# Altium schematic sheet Fast PLL.SchDoc: Fast PLL (part 2 of 2)
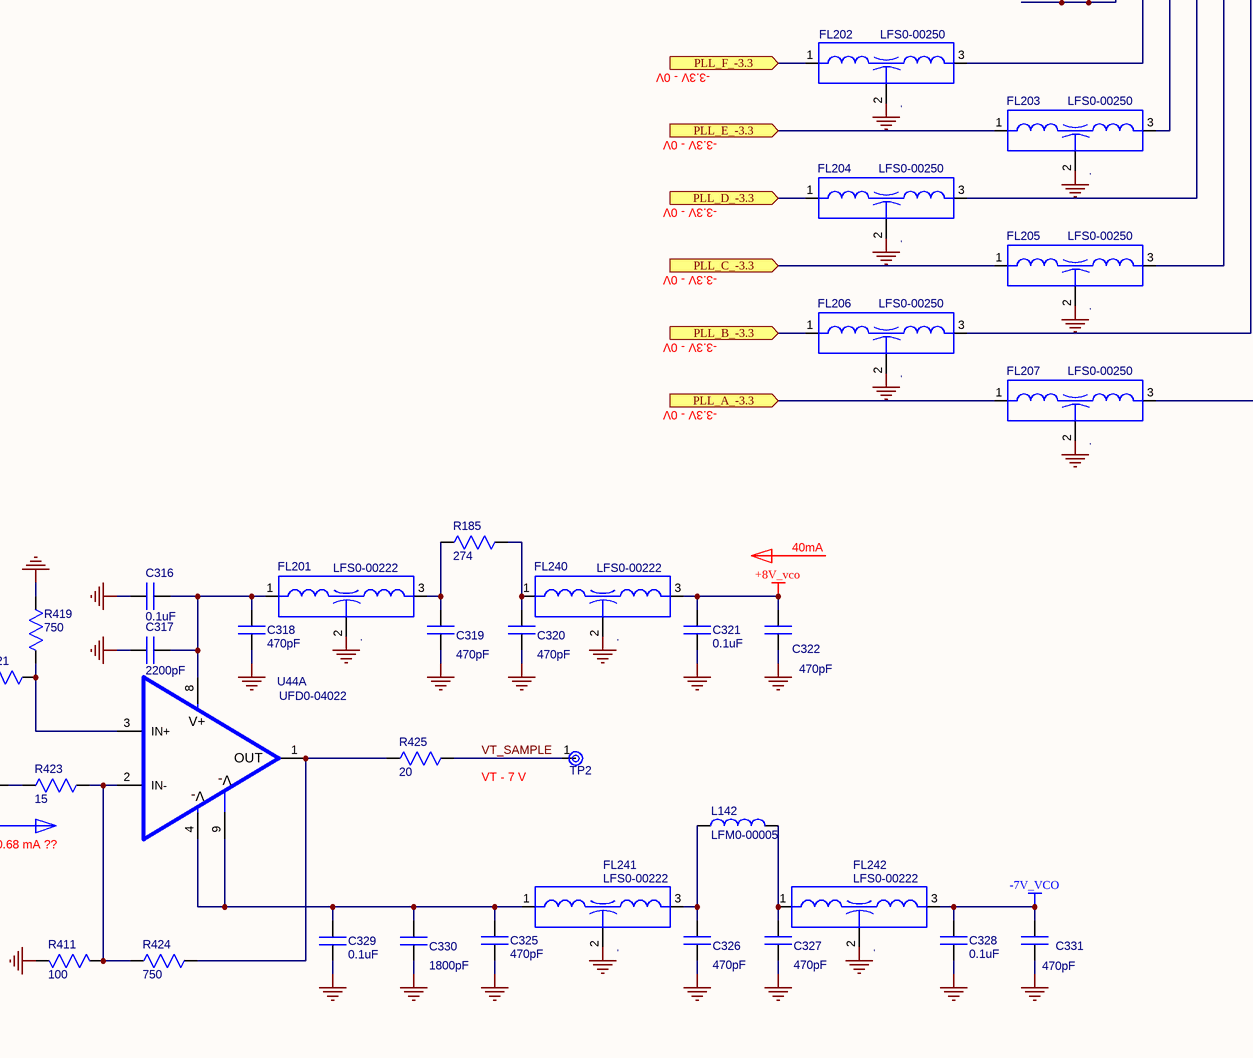
[diagram p6: Fast PLL.SchDoc, bottom right]

## Library data of the parts
AT20 = MPFC-A1000: NoLoad: .; Approved: CL; M_PN: IMS1141-00DB; MFGR: IMS RESISTORS; level: 1; line_number: 50; ModifyDate: 4/16/13; G_PN: MPFC-A1000; item_number: MPFC-A1000
AT21 = MPFC-A1820: NoLoad: .; Approved: CL; MFGR: Aeroflex/Inmet; level: 1; line_number: 32; ModifyDate: 1/20/15; M_PN: MPFC-A1820; G_PN: MPFC-A1820; item_number: MPFC-A1820
C22 C294 C303 C461 = CK35-01470: MFGR: VENKEL; M_PN: C0201X7R250-471JNP; Approved: CL; NoLoad: .; level: 1; line_number: 112; ModifyDate: 7/23/13; G_PN: CK35-01470; item_number: CK35-01470
C23 C26 C30 C170 C223 C224 C229 C264 C270 C271 C273 C278 C280 C287 C289 C300 C302 C319 C320 C322 C326 C327 C331 C414 C415 C417 C462-C464 C1239 = CK40-01470: MFGR: Any; Approved: CL; NoLoad: .; level: 1; line_number: 75; ModifyDate: 02/22/12; M_PN: Any; G_PN: CK40-01470; item_number: CK40-01470
C27 C43 C44 C68 C92 C99 C127 C169 C221 C225 C228 C262 C275 C281 C288 C297 C298 C306 C307 C310 C311 C315 C316 C321 C323 C328 C329 C362 C458 C459 C468 C470 C1210 = CK40-04100: Approved: CL; NoLoad: .; MFGR: VENKEL; M_PN: C0402X7R160-104KNP; level: 1; line_number: 95; ModifyDate: 3/29/13; G_PN: CK40-04100; item_number: CK40-04100
C31 C32 C42 C75 C98 C226 C244 C246 C269 C291 C299 C304 C313 C314 C363 C465 C467 C471 = CK40-01470: Approved: CL; NoLoad: .; MFGR: Any; level: 1; line_number: 75; G_PN: CK40-01470; ModifyDate: 02/22/12; M_PN: Any; item_number: CK40-01470
C33 C36 C39 C52 C53 C337 = CK41-00015: Approved: CL; NoLoad: .; M_PN: 600L1R5AT200; MFGR: ATC; level: 1; line_number: 170; G_PN: CK41-00015; ModifyDate: 02/09/13; item_number: CK41-00015
C34 C37 C46 C335 = CK41-00018: Approved: CL; NoLoad: .; M_PN: 600L1R8AT200; MFGR: ATC; level: 1; line_number: 175; G_PN: CK41-00018; ModifyDate: 02/09/13; item_number: CK41-00018
C35 C38 C332 C336 = CK41-00082: Approved: CL; NoLoad: .; M_PN: 600L8R2BT200; MFGR: ATC; level: 1; line_number: 180; G_PN: CK41-00082; ModifyDate: 4/23/12; item_number: CK41-00082
C40 C49 C50 C333 = CK41-00012: Approved: CL; NoLoad: .; M_PN: 600L1R2AT200; MFGR: ATC; level: 1; line_number: 195; G_PN: CK41-00012; ModifyDate: 02/22/13; item_number: CK41-00012
C41 C47 = CK41-00091: Approved: CL; NoLoad: .; M_PN: 600L9R1BT200; MFGR: ATC; level: 1; line_number: 200; G_PN: CK41-00091; ModifyDate: 3/221/12; item_number: CK41-00091
C45 C48 C334 = CK41-00068: Approved: CL; NoLoad: .; M_PN: 600L6R8BT200; MFGR: ATC; level: 1; line_number: 210; G_PN: CK41-00068; ModifyDate: 02/22/12; item_number: CK41-00068
C54-C56 C58 C339 = CK41-00006: Approved: CL; NoLoad: .; M_PN: 600L0R6AT200; MFGR: ATC; level: 1; line_number: 225; G_PN: CK41-00006; ModifyDate: 02/22/12; item_number: CK41-00006
C57 C338 = CK41-00008: Approved: CL; NoLoad: .; M_PN: 600L0R8AT200; MFGR: ATC; level: 1; line_number: 230; G_PN: CK41-00008; ModifyDate: 02/20/13; item_number: CK41-00008
C161 C364 C397 C1101 = CK35-00270: Approved: CL; NoLoad: .; MFGR: VENKEL; M_PN: C0201C0G500-270JNP; level: 1; line_number: 97; G_PN: CK35-00270; ModifyDate: 8/2/13; item_number: CK35-00270
C163 C406-C409 C418 = CK40-00270: Approved: CL; NoLoad: .; MFGR: ANY; level: 1; line_number: 215; G_PN: CK40-00270; ModifyDate: 02/22/12; M_PN: ANY; item_number: CK40-00270
C167 C242 C263 C272 C292 C305 C410 C411 C413 C460 C466 C1209 = CK45-14100: Approved: CL; NoLoad: .; MFGR: VENKEL; M_PN: C0603X7R500-104JNE; level: 1; line_number: 65; ModifyDate: 3/29/13; G_PN: CK45-14100; item_number: CK45-14100
C168 C266 C268 C277 C318 C325 C383 C384 C386 C404 C405 C442-C444 C455-C457 = CK35-01470: Approved: CL; NoLoad: .; MFGR: VENKEL; M_PN: C0201X7R250-471JNP; level: 1; line_number: 112; ModifyDate: 7/23/13; G_PN: CK35-01470; item_number: CK35-01470
C174 = CK40-01150: Approved: CL; NoLoad: .; MFGR: Any; level: 1; line_number: 100; G_PN: CK40-01150; ModifyDate: 2/1/14; M_PN: Any; item_number: CK40-01150
C219 C220 = CK40-00100: NoLoad: .; MFGR: ANY; Approved: CL; level: 1; line_number: 110; G_PN: CK40-00100; ModifyDate: 4/9/12; M_PN: ANY; item_number: CK40-00100
C243 C265 C267 C276 C296 C330 = CK40-02180: Approved: CL; NoLoad: .; MFGR: Any; level: 1; line_number: 135; G_PN: CK40-02180; ModifyDate: 02/22/12; M_PN: Any; item_number: CK40-02180
C247 C249 = CK41-00003: Approved: CL; NoLoad: .; M_PN: 600L0R3AT200T; MFGR: ATC; level: 1; line_number: 140; G_PN: CK41-00003; ModifyDate: 01/23/14; item_number: CK41-00003
C248 C250 C274 C282 C284 = CK41-00002: Approved: CL; NoLoad: .; M_PN: 600L0R2AT200; MFGR: ATC; level: 1; line_number: 145; G_PN: CK41-00002; ModifyDate: 02/14/13; item_number: CK41-00002
C251 C295 = CK35-00010: Approved: CL; NoLoad: .; M_PN: C0201C0G500-1R0BNP; MFGR: VENKEL; level: 1; line_number: 147; G_PN: CK35-00010; ModifyDate: 7/23/13; item_number: CK35-00010
C279 C286 = CK40-00270: Approved: CL; MFGR: ANY; NoLoad: .; level: 1; line_number: 215; ModifyDate: 02/22/12; G_PN: CK40-00270; M_PN: ANY; item_number: CK40-00270
C283 C285 = CK41-00004: Approved: CL; NoLoad: .; M_PN: 600L0R4AT200; MFGR: ATC; level: 1; line_number: 160; G_PN: CK41-00004; ModifyDate: 02/14/13; item_number: CK41-00004
C290 = CK45-01470: Approved: CL; NoLoad: .; MFGR: ANY; level: 1; line_number: 190; G_PN: CK45-01470; ModifyDate: 4/9/12; M_PN: ANY; item_number: CK45-01470
C293 C416 C1213 C1238 = CK45-04100: Approved: CL; NoLoad: .; MFGR: ANY; level: 1; line_number: 105; ModifyDate: 02/22/12; G_PN: CK45-04100; M_PN: ANY; item_number: CK45-04100
C308 C309 C312 C317 = CK35-02220: Approved: CL; NoLoad: .; MFGR: VENKEL; M_PN: C0201X7R250-222JNP; level: 1; line_number: 167; G_PN: CK35-02220; ModifyDate: 7/23/13; item_number: CK35-02220
C412 = CK40-01470: 470 PF;5%;COG;>50V;CHIP;0402; MFGR: Any; Approved: CL; level: 1; line_number: 75; ModifyDate: 02/22/12; M_PN: Any; NoLoad: .; G_PN: CK40-01470; item_number: CK40-01470
C469 = CK40-01470: 470 PF;5%;COG;>50V;CHIP;0402; Approved: CL; NoLoad: .; MFGR: Any; level: 1; line_number: 75; G_PN: CK40-01470; ModifyDate: 02/22/12; M_PN: Any; item_number: CK40-01470
C830 = CK35-00027: Approved: CL; NoLoad: .; MFGR: VENKEL; M_PN: C0201C0G500-2R7BNP; level: 1; line_number: 310; G_PN: CK35-00027; ModifyDate: 6/13/13; item_number: CK35-00027
C1208 = CF16-S5100: NoLoad: .; M_PN: ECP-U1C105MA5; MFGR: PANASONIC; Approved: CL; level: 1; line_number: 80; G_PN: CF16-S5100; ModifyDate: 02/22/12; item_number: CF16-S5100
C1211 C1212 = CT35-S6331: Approved: CL; NoLoad: .; MFGR: VISHAY; M_PN: TCJD336M035R0070; level: 1; line_number: 85; G_PN: CT35-S6331; ModifyDate: 4/30/12; item_number: CT35-S6331
CR20 = DSA2-02812: DUAL RF DIODE; SCHOTTKY;.4V@1MA; 1.2PF; SOT-23; NoLoad: .; MFGR: AVAGO; Approved: CL; level: 1; line_number: 330; Value: HSMS-2812; M_PN: HSMS-2812; ModifyDate: 3/6/12; G_PN: DSA2-02812; item_number: DSA2-02812
FL14 FL19 FL20 FL140 FL154 FL169 FL179-FL181 FL195 FL198 FL201 FL240-FL242 FL248-FL255 = LFS0-00222: Approved: CL; NoLoad: .; M_PN: NFE31PT222Z1E9BL; MFGR: MURATA; level: 1; line_number: 335; G_PN: LFS0-00222; ModifyDate: 02/22/12; Value: 2200pF; item_number: LFS0-00222
FL26 = LFS0-00222: Approved: CL; MFGR: MURATA; NoLoad: .; M_PN: NFE31PT222Z1E9BL; level: 1; line_number: 335; Value: 2200pF; G_PN: LFS0-00222; ModifyDate: 02/22/12; item_number: LFS0-00222
FL135 FL160 FL167 FL182 FL191 FL192 FL197 FL202-FL209 FL295 = LFS0-00250: Approved: NM; MFGR: MURATA; NoLoad: .; M_PN: NFL18ST207X1C3; level: 1; line_number: 415; Value: 25pF; G_PN: LFS0-00250; ModifyDate: 02/22/12; item_number: LFS0-00250
FL136 FL139 FL178 FL183 FL199 FL200 FL243 = LFS1-00222: 2200 PF FEED THRU FILTER 0603; Value: 2200pF; Approved: NM; MFGR: muRata; NoLoad: .; level: 1; line_number: 475; ModifyDate: 11/14/12; M_PN: NFM18CC222R1C3; G_PN: LFS1-00222; item_number: LFS1-00222
FL246 = MFH0-00880: MFGR: MINI-CIRCUITS; Approved: CL; Value: HFCN-880+; NoLoad: .; level: 1; line_number: 380; G_PN: MFH0-00880; ModifyDate: 7/5/12; item_number: MFH0-00880
FL247 = MFL0-01800: MFGR: MINI-CIRCUITS; Approved: NM; Value: LFCN-1800+; NoLoad: .; level: 1; line_number: 360; G_PN: MFL0-01800; ModifyDate: 11/17/12; item_number: MFL0-01800
FT2 FT3 FT13 FT27 FT29 = FromToNode: level: 1; Approved: *; G_PN: *; MFGR: *; Value: *
L21 L22 L39 L40 L44 L45 L49 L50 L119 L131 L132 L137 L139 L140 L142 L163 L173 = LFM0-00005: MFGR: MuRata; NoLoad: .; Approved: NM; M_PN: BLM18AG331SN1; level: 1; line_number: 570; ModifyDate: 10/24/12; G_PN: LFM0-00005; item_number: LFM0-00005
L23 L26 = LSA5-02870: M_PN: 0603HP-8N7XGLU; MFGR: COILCRAFT; NoLoad: .; Approved: CL; level: 1; line_number: 575; G_PN: LSA5-02870; ModifyDate: 02/22/13; item_number: LSA5-02870
L24 L27 L143 = LSA5-03150: MFGR: COILCRAFT; NoLoad: .; Approved: CL; M_PN: 0603HP-15NXGLU; level: 1; line_number: 540; G_PN: LSA5-03150; ModifyDate: 2/20/13; item_number: LSA5-03150
L25 L28 L144 = LSA5-02820: M_PN: 0603HP-8N2XGLU; MFGR: COILCRAFT; NoLoad: .; Approved: CL; level: 1; line_number: 545; G_PN: LSA5-02820; ModifyDate: 03/20/12; item_number: LSA5-02820
L29 L30 = LSA5-02680: M_PN: 0603HP-6N8XGLU; MFGR: COILCRAFT; NoLoad: .; Approved: CL; level: 1; line_number: 550; G_PN: LSA5-02680; ModifyDate: 2/20/13; item_number: LSA5-02680
L31 L34 L37 = LSA5-04150: MFGR: COILCRAFT; NoLoad: .; Approved: CL; M_PN: 0603HP-R15XGLU; level: 1; line_number: 555; G_PN: LSA5-04150; ModifyDate: 5/16/12; item_number: LSA5-04150
L32 L35 L38 = LSA5-03750: M_PN: 0603HP-75NXGLU; MFGR: COILCRAFT; NoLoad: .; Approved: CL; level: 1; line_number: 560; G_PN: LSA5-03750; ModifyDate: 02/22/12; item_number: LSA5-03750
L33 L36 = LSA5-03270: M_PN: 0603HP-27NXGLU; MFGR: COILCRAFT; NoLoad: .; Approved: CL; level: 1; line_number: 565; G_PN: LSA5-03270; ModifyDate: 3/11/13; item_number: LSA5-03270
L120 L121 L129 L130 L133-L136 = LSA6-02560: NoLoad: .; Approved: CL; M_PN: 0402HP-5N6XGLU; MFGR: COILCRAFT; level: 1; line_number: 595; G_PN: LSA6-02560; ModifyDate: 3/4/13; item_number: LSA6-02560
L145 L146 = LSA5-03180: M_PN: 0603HP-18NXGLU; MFGR: COILCRAFT; NoLoad: .; Approved: CL; level: 1; line_number: 605; G_PN: LSA5-03180; ModifyDate: 02/22/12; item_number: LSA5-03180
L172 = LSA3-14100: M_PN: 0603CS-R10XJBU; MFGR: COILCRAFT; NoLoad: .; Approved: CL; level: 1; line_number: 525; ModifyDate: 02/22/12; G_PN: LSA3-14100; item_number: LSA3-14100
L255 = LSA6-03220: M_PN: 0402HP-22NXGLU; MFGR: COILCRAFT; NoLoad: .; Approved: CL; level: 1; line_number: 546; G_PN: LSA6-03220; ModifyDate: 6/20/14; item_number: LSA6-03220
MTG35 MTG62-MTG66 MTG73 MTG78 MTG79 MTG96 MTG117-MTG146 MTG173-MTG177 = MHP200X92: level: 1; ModifyDate: 02/14/2008 14:07:19; Value: *
MTG103 MTG109 = MHP150X67: MHP200X92; level: 1; ModifyDate: 02/14/2008 14:07:19; Value: *
Q3 = QBNC-03904: .2A IC;40V;.3W;100-300HFE;300MHZ;SOT-23; NoLoad: .; Approved: CL; MFGR: ON SEMI; level: 1; line_number: 640; M_PN: MMBT3904LT1; Value: MMBT3904LT1; ModifyDate: 02/22/12; G_PN: QBNC-03904; item_number: QBNC-03904
R16 R172-R177 = RK40-00000: Approved: CL; NoLoad: .; MFGR: ANY; level: 1; line_number: 710; G_PN: RK40-00000; ModifyDate: 3/27/13; M_PN: ANY; item_number: RK40-00000
R56 = RK30-00221: Approved: CL; NoLoad: .; MFGR: Vishay-Dale; M_PN: CRCW020122R1FNED; level: 1; line_number: 965; G_PN: RK30-00221; ModifyDate: 2/26/14; item_number: RK30-00221
R63 = RK30-00000: Approved: CL; MFGR: Vishay-Dale; M_PN: CRCW02010000Z0ED; Value: 0 ohm; level: 1; line_number: 1003; G_PN: RK30-00000; ModifyDate: 8/2/13; item_number: RK30-00000
R108 = RK35-00150: Approved: CL; NoLoad: .; MFGR: ANY; level: 1; line_number: 915; G_PN: RK35-00150; ModifyDate: 02/22/13; M_PN: ANY; item_number: RK35-00150
R185 = RK41-02740: Approved: CL; NoLoad: .; MFGR: PANASONIC; M_PN: ERJ-3EKF2740V; level: 1; line_number: 722; G_PN: RK41-02740; ModifyDate: 7/24/14; item_number: RK41-02740
R254 R451 = RK35-03090: NoLoad: .; MFGR: ANY; Approved: CL; level: 1; line_number: 765; ModifyDate: 02/22/12; M_PN: ANY; G_PN: RK35-03090; item_number: RK35-03090
R270 R355 R412 = RK35-00200: Approved: CL; NoLoad: .; MFGR: ANY; level: 1; line_number: 780; G_PN: RK35-00200; ModifyDate: 02/22/12; M_PN: ANY; item_number: RK35-00200
R271 = RK30-00200: Approved: CL; NoLoad: .; MFGR: Vishay-Dale; M_PN: CRCW020120R0FNED; level: 1; line_number: 782; G_PN: RK30-00200; ModifyDate: 7/24/13; item_number: RK30-00200
R272 R290 = RK30-07500: NoLoad: .; MFGR: Vishay-Dale; M_PN: CRCW0201750RFKED; Approved: CL; level: 1; line_number: 725; G_PN: RK30-07500; ModifyDate: 7/25/13; item_number: RK30-07500
R273 R342-R344 R411 R427 R682 = RK30-01000: Approved: CL; NoLoad: .; MFGR: Vishay-Dala; M_PN: CRCW0201100RFKED; level: 1; line_number: 787; G_PN: RK30-01000; ModifyDate: 7/23/13; item_number: RK30-01000
R274 R285 = RK30-02000: Approved: CL; NoLoad: .; MFGR: Vishay-Dale; M_PN: CRCW0201200RFKED; level: 1; line_number: 788; G_PN: RK30-02000; ModifyDate: 7/25/13; item_number: RK30-02000
R276 = RK30-00274: Approved: CL; MFGR: KOA SPEER; M_PN: RK73H1HTTC27R4F; NoLoad: .; level: 1; line_number: 789; ModifyDate: 6/27/14; G_PN: RK30-00274; item_number: RK30-00274
R280 = RK30-02000: NoLoad: .; MFGR: Vishay-Dale; M_PN: CRCW0201200RFKED; Approved: CL; level: 1; line_number: 788; ModifyDate: 7/25/13; G_PN: RK30-02000; item_number: RK30-02000
R286 = RK40-04530: Approved: NM; NoLoad: .; MFGR: ANY; level: 1; line_number: 812; G_PN: RK40-04530; ModifyDate: 2/1/14; M_PN: ANY; item_number: RK40-04530
R287 = RK30-00000: Approved: CL; NoLoad: .; MFGR: Vishay-Dale; M_PN: CRCW02010000Z0ED; level: 1; line_number: 1003; G_PN: RK30-00000; ModifyDate: 8/2/13; item_number: RK30-00000
R288 = RK35-00174: NoLoad: .; Approved: CL; MFGR: ANY; level: 1; line_number: 815; G_PN: RK35-00174; ModifyDate: 02/22/12; M_PN: ANY; item_number: RK35-00174
R329 R330 = RK30-11500: Approved: CL; NoLoad: .; MFGR: Vishay-Dale; M_PN: CRCW02011K50FKED; level: 1; line_number: 840; G_PN: RK30-11500; ModifyDate: 7/29/13; item_number: RK30-11500
R331 R336 = RK35-R0549: Approved: CL; NoLoad: .; MFGR: ANY; level: 1; line_number: 845; G_PN: RK35-R0549; ModifyDate: 07/30/12; M_PN: ANY; item_number: RK35-R0549
R332 R338 = RK35-02940: NoLoad: .; Approved: CL; MFGR: ANY; level: 1; line_number: 847; G_PN: RK35-02940; ModifyDate: 02/22/12; M_PN: ANY; item_number: RK35-02940
R334 R335 R1269 = RK35-02000: Approved: CL; NoLoad: .; MFGR: ANY; level: 1; line_number: 790; G_PN: RK35-02000; ModifyDate: 02/22/12; M_PN: ANY; item_number: RK35-02000
R339 = RK35-00499: Approved: CL; NoLoad: .; MFGR: ANY; level: 1; line_number: 650; ModifyDate: 02/22/12; G_PN: RK35-00499; M_PN: ANY; item_number: RK35-00499
R340 = TRC3-00500: Approved: CL; NoLoad: .; MFGR: ANY; level: 1; line_number: 860; G_PN: TRC3-00500; ModifyDate: 02/27/13; M_PN: ANY; item_number: TRC3-00500
R341 R428 = RK35-04320: NoLoad: .; MFGR: ANY; Approved: CL; level: 1; line_number: 865; G_PN: RK35-04320; ModifyDate: 02/22/12; M_PN: ANY; item_number: RK35-04320
R352 = RK35-07500: NoLoad: .; MFGR: ANY; Approved: CL; level: 1; line_number: 785; G_PN: RK35-07500; M_PN: ANY; ModifyDate: 4/11/12; item_number: RK35-07500
R353 = RK35-07870: NoLoad: .; MFGR: ANY; Approved: CL; level: 1; line_number: 870; G_PN: RK35-07870; M_PN: ANY; ModifyDate: 2/22/13; item_number: RK35-07870
R354 = RK30-12000: NoLoad: .; MFGR: Vishay-Dale; M_PN: CRCW02012K00FKED; Approved: CL; level: 1; line_number: 872; G_PN: RK30-12000; ModifyDate: 7/31/13; item_number: RK30-12000
R356 = RK35-00274: NoLoad: .; Approved: CL; MFGR: ANY; level: 1; line_number: 875; G_PN: RK35-00274; ModifyDate: 2/22/13; M_PN: ANY; item_number: RK35-00274
R357 = RK35-03320: NoLoad: .; MFGR: ANY; Approved: CL; level: 1; line_number: 897; G_PN: RK35-03320; M_PN: ANY; ModifyDate: 4/9/12; item_number: RK35-03320
R358 R777 = RK35-01500: NoLoad: .; Approved: CL; MFGR: ANY; level: 1; line_number: 850; G_PN: RK35-01500; ModifyDate: 02/22/12; M_PN: ANY; item_number: RK35-01500
R410 = RK30-02210: NoLoad: .; MFGR: Vishay-Dale; M_PN: CRCW0201200RFKED; Approved: CL; level: 1; line_number: 908; G_PN: RK30-02210; ModifyDate: 2/26/14; item_number: RK30-02210
R415 = RK30-21000: Approved: CL; NoLoad: .; MFGR: Vishay-Dale; M_PN: CRCW020110K0FKED; level: 1; line_number: 905; G_PN: RK30-21000; ModifyDate: 7/31/13; item_number: RK30-21000
R419 R424 = RK30-07500: NoLoad: .; Approved: CL; MFGR: Vishay-Dale; M_PN: CRCW0201750RFKED; level: 1; line_number: 725; G_PN: RK30-07500; ModifyDate: 7/25/13; item_number: RK30-07500
R420 = RK35-16040: NoLoad: .; Approved: CL; MFGR: ANY; level: 1; line_number: 910; G_PN: RK35-16040; ModifyDate: 4/11/12; M_PN: ANY; item_number: RK35-16040
R421 = RK30-00150: Approved: CL; NoLoad: .; M_PN: CRCW020115R0FNED; MFGR: Vishay-Dale; level: 1; line_number: 911; G_PN: RK30-00150; ModifyDate: 2/26/14; item_number: RK30-00150
R422 = RK30-11270: NoLoad: .; Approved: CL; MFGR: Vishay-Dale; M_PN: CRCW02011K27FKED; level: 1; line_number: 898; G_PN: RK30-11270; ModifyDate: 7/30/13; item_number: RK30-11270
R423 = RK40-00150: Approved: CL; NoLoad: .; M_PN: ANY; level: 1; line_number: 912; G_PN: RK40-00150; ModifyDate: 7/30/13; MFGR: ANY; item_number: RK40-00150
R425 = RK30-00200: Approved: CL; MFGR: Vishay-Dale; M_PN: CRCW020120R0FNED; NoLoad: .; level: 1; line_number: 782; ModifyDate: 7/24/13; G_PN: RK30-00200; item_number: RK30-00200
R426 = RK35-11000: NoLoad: .; Approved: CL; MFGR: ANY; level: 1; line_number: 1025; G_PN: RK35-11000; ModifyDate: 02/22/12; M_PN: ANY; item_number: RK35-11000
R450 = RK35-00162: Approved: CL; NoLoad: .; M_PN: ANY; level: 1; line_number: 935; G_PN: RK35-00162; ModifyDate: 02/28/13; MFGR: ANY; item_number: RK35-00162
R452 R454 = RK35-00768: Approved: CL; NoLoad: .; MFGR: ANY; level: 1; line_number: 940; G_PN: RK35-00768; ModifyDate: 2/28/113; M_PN: ANY; item_number: RK35-00768
R453 = RK35-01130: NoLoad: .; MFGR: ANY; Approved: CL; level: 1; line_number: 945; ModifyDate: 02/28/13; G_PN: RK35-01130; M_PN: ANY; item_number: RK35-01130
R455 = RK65-00511: NoLoad: .; Approved: CL; MFGR: VISHAY/DALE; M_PN: CRCW201040R2FKEF; level: 1; line_number: 950; G_PN: RK65-00511; ModifyDate: 2/28/13; item_number: RK65-00511
R776 R778 = RK35-11000: Approved: CL; NoLoad: .; MFGR: ANY; level: 1; line_number: 1025; G_PN: RK35-11000; ModifyDate: 02/22/12; M_PN: ANY; item_number: RK35-11000
R779 = RK35-12000: Approved: CL; NoLoad: .; MFGR: ANY; level: 1; line_number: 660; G_PN: RK35-12000; ModifyDate: 02/22/12; M_PN: ANY; item_number: RK35-12000
R1337 = RK35-00475: NoLoad: .; Approved: CL; MFGR: ANY; level: 1; line_number: 712; G_PN: RK35-00475; ModifyDate: 4/9/12; M_PN: ANY; item_number: RK35-00475
SW1 = ULD0-00613: Value: DG613DY; MFGR: VISHAY; NoLoad: .; Approved: NM; level: 1; line_number: 1060; ModifyDate: 2/20/13; M_PN: DG613DY; G_PN: ULD0-00613; item_number: ULD0-00613
TP2 = ETS0-06303: Value: RCUCTE; MFGR: KOA; NoLoad: .; Approved: CL; level: 1; line_number: 1093; M_PN: RCUCTE; ModifyDate: 5/24/12; G_PN: ETS0-06303; item_number: ETS0-06303
U41 = UTD4-00329: NoLoad: .; Approved: CL; MFGR: ON SEMI; level: 1; line_number: 1220; Value: M74VHC1GT32DFT1G; G_PN: UTD4-00329; ModifyDate: 6/21/14; M_PN: M74VHC1GT32DFT1G; item_number: UTD4-00329
U44 = UFD0-04022: Value: THS4022CDGN; NoLoad: .; Approved: NM; MFGR: Texas Instruments; level: 1; line_number: 1231; ModifyDate: 6/18/14; G_PN: UFD0-04022; M_PN: THS4022CDGN; item_number: UFD0-04022
U46 = UID0-09748: MFGR: ANALOG DEVICES; Approved: NM; NoLoad: .; level: 1; line_number: 1240; ModifyDate: 12/05/12; G_PN: UID0-09748; item_number: UID0-09748
U73 = MYVT-00612: MFGR: Hittite; NoLoad: .; Approved: NM; M_PN: HMC732LC4B; level: 1; line_number: 1295; Value: *; ModifyDate: 10/27/12; G_PN: MYVT-00612; item_number: MYVT-00612
U74 = UFD0-03202: Value: LM393M; NoLoad: .; Approved: NM; MFGR: Texas Instruments; M_PN: THS3202; level: 1; line_number: 1235; ModifyDate: 12/04/12; G_PN: UFD0-03202; item_number: UFD0-03202
U75 = UID0-00439: DIG PHASE-FREQ DET;10-1300MHz;QS-16; M_PN: HMC439QS16G; Value: HMC439QS16G; NoLoad: .; Approved: CL; MFGR: HITTITE; level: 1; line_number: 1300; ModifyDate: 5/31/13; G_PN: UID0-00439; item_number: UID0-00439
U86 = UID0-00794: Value: HMC794LP3E; NoLoad: .; Approved: NM; MFGR: Hittite; level: 1; line_number: 1325; G_PN: UID0-00794; ModifyDate: 2/25/13; M_PN: HMC794LP3E; item_number: UID0-00794
U87 = UID0-00149: NoLoad: .; Approved: NM; MFGR: CENTELLAX; M_PN: UXN14M9P; level: 1; line_number: 1330; ModifyDate: 11/19/12; Value: UID0-00149; G_PN: UID0-00149; item_number: UID0-00149
U88 = MCS0-02541: NoLoad: .; MFGR: ANY; M_PN: IPS2541-C; Approved: CL; Value: IPS2541-C; level: 1; line_number: 1335; G_PN: MCS0-02541; ModifyDate: 2/27/13; item_number: MCS0-02541
U119 = MA13-06289: Value: SGA6289Z; NoLoad: .; Approved: CL; MFGR: RFMD; level: 1; line_number: 1125; ModifyDate: 2/28/13; G_PN: MA13-06289; item_number: MA13-06289
U167 = UFD0-04004: MFGR: ANALOG DEVICES; NoLoad: .; Approved: CL; Value: ADA4004-1ARJZ-R7; level: 1; line_number: 1145; ModifyDate: 5/12/13; M_PN: ADA4004-1ARJZ-R7; G_PN: UFD0-04004; item_number: UFD0-04004
X3 = LTR3-S0104: M_PN: TC4-25+; NoLoad: .; MFGR: MINICIRCUITS; Approved: CL; Value: TC4-25+; level: 1; line_number: 1075; ModifyDate: 2/25/13; G_PN: LTR3-S0104; item_number: LTR3-S0104
X4 = LTR2-S0104: M_PN: TCM4-6T+; NoLoad: .; MFGR: MINICIRCUITS; Approved: CL; Value: TCM4-6T+; level: 1; line_number: 1080; ModifyDate: 2/25/13; G_PN: LTR2-S0104; item_number: LTR2-S0104